# Altium schematic sheet FB_Control.SchDoc
size A4; SheetNumber: 3; SheetTotal: 3
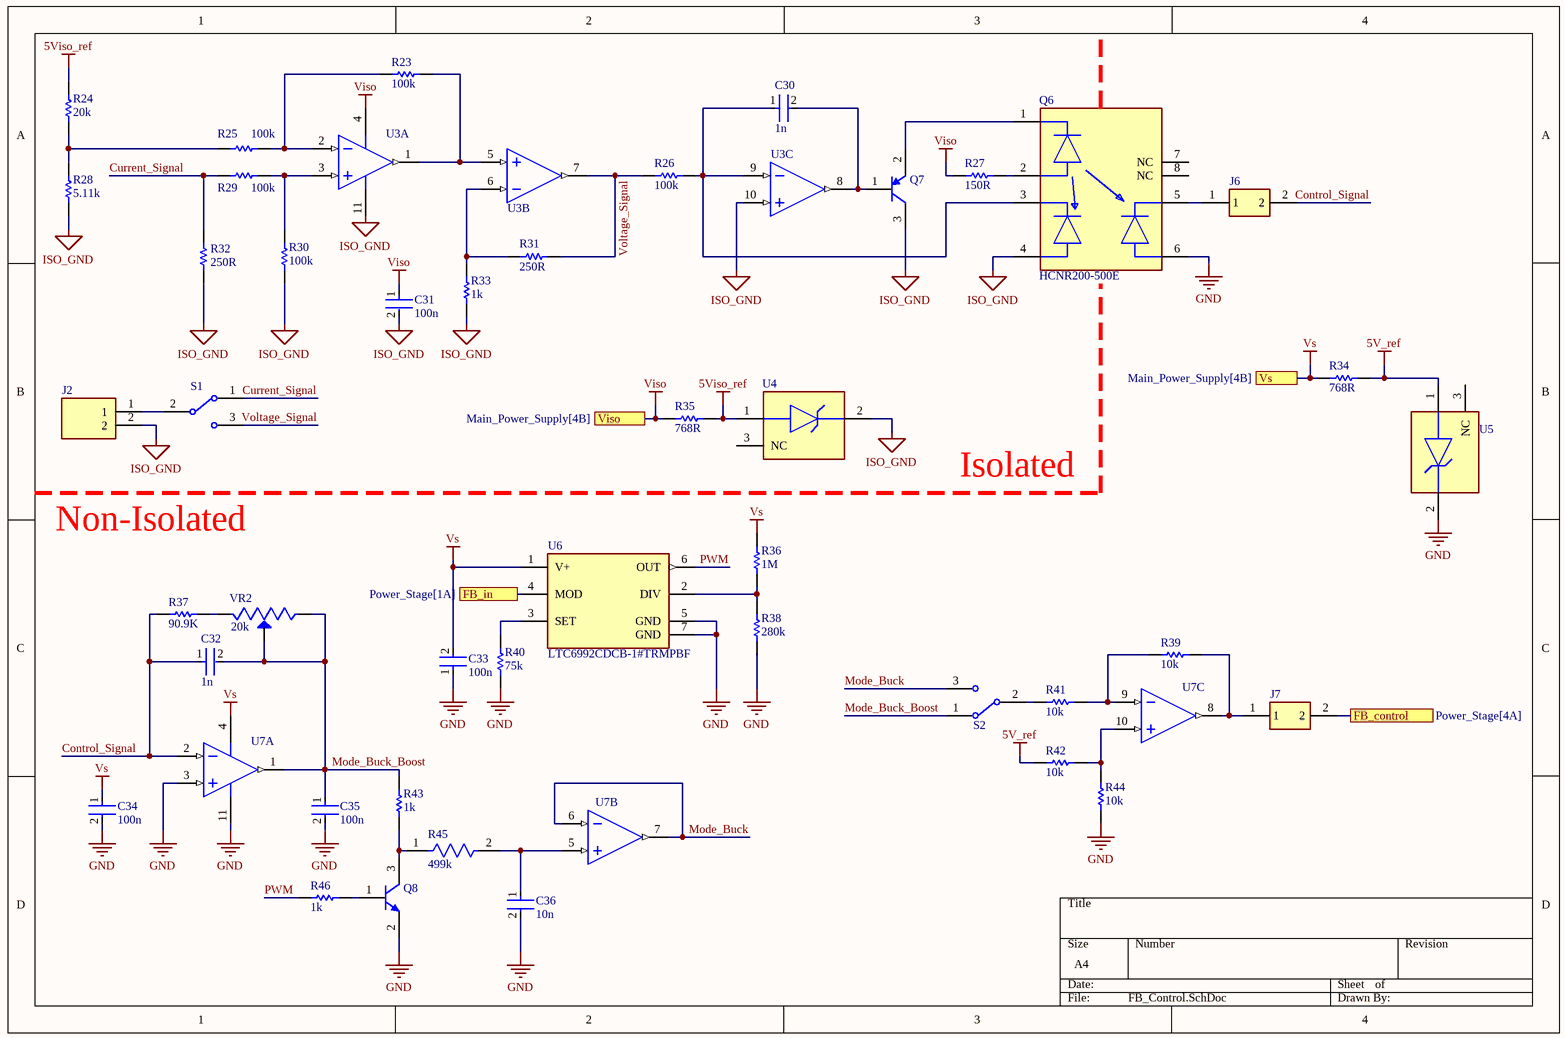
[diagram p0: FB_Control.SchDoc]

## Parts
C30  1n  [FP-1206-L_3_2_0_2-W_1_6_0-IPC_C]
C31  100n  [FP-0805-L_2_01_0_2-W_1_25-MFG]
C32  1n  [FP-1206-L_3_2_0_2-W_1_6_0-IPC_C]
C33  100n  [FP-0805-L_2_01_0_2-W_1_25-MFG]
C34  100n  [FP-0805-L_2_01_0_2-W_1_25-MFG]
C35  100n  [FP-0805-L_2_01_0_2-W_1_25-MFG]
C36  10n  [FP-0805-L_2_01_0_2-W_1_25-IPC_B]
J2  TB001-500-02BE  [TB00150002BE]  (value not drawn)
J6  22-28-4020  [MOLEX_22-28-4020]  (value not drawn)
J7  22-28-4020  [MOLEX_22-28-4020]  (value not drawn)
Q6  HCNR200-500E  [FP-HCNR200-500E-MFG]
Q7  MMBT3906TT1G  [ONSC-SC-75-3-463-01_V]  (value not drawn)
Q8  MMBT3904LT1G  [ONSC-SOT-23-3-318-08_V]  (value not drawn)
R23  100k  [RESC1608X55X30ML15T15]
R24  20k  [RESC1608X55X30ML15T15]
R25  100k  [RESC1608X55X30ML15T15]
R26  100k  [RESC1608X55X30ML15T15]
R27  150R  [RESC1608X55X30NL15T15]
R28  5.11k  [RESC1608X55X30LL15T15]
R29  100k  [RESC1608X55X30ML15T15]
R30  100k  [RESC1608X55X30ML15T15]
R31  250R  [RESC1608X55N]
R32  250R  [RESC1608X55N]
R33  1k  [RESC1608X55X30LL15T15]
R34  768R  [RESC1608X55X30LL15T15]
R35  768R  [RESC1608X55X30LL15T15]
R36  1M  [RESC1608X55X25LL10T15]
R37  90.9K  [RESC1608X55X30ML15T15]
R38  280k  [RESC1608X55X30LL15T15]
R39  10k  [RESC1609X55X30LL15T15]
R40  75k  [RESC1608X55X30NL15T15]
R41  10k  [RESC1609X55X30LL15T15]
R42  10k  [RESC1609X55X30LL15T15]
R43  1k  [RESC1608X55X30LL15T15]
R44  10k  [RESC1609X55X30LL15T15]
R45  499k  [FP-ERJ3EK-IPC_B]
R46  1k  [RESC1608X55X30LL15T15]
S1  100SP1T1B1M2QEH  [100SP1T1B4M2QE]  (value not drawn)
S2  100SP1T1B1M2QEH  [100SP1T1B4M2QE]  (value not drawn)
U3  AD8534ARUZ-REEL  [ADI-RU-14_L]  (value not drawn)  (parts A,B,C of 4)
U4  LM4040CYM3-5.0-TR  [FP-SOT23-3LD-PL-1-MFG]  (value not drawn)
U5  LM4040CYM3-5.0-TR  [FP-SOT23-3LD-PL-1-MFG]  (value not drawn)
U6  LTC6992CDCB-1#TRMPBF  [FP-DCB-6-05-08-1715-MFG]
U7  AD8534ARUZ-REEL  [ADI-RU-14_L]  (value not drawn)  (parts A,B,C of 4)
VR2  value 20k  [TRIM_3296W-1-203LF]  (hidden comment: 3296W-1-203LF)

## Ports
FB_control (see Power_Stage[4A]), FB_in (see Power_Stage[1A]), Viso (see Main_Power_Supply[4B]), Vs (see Main_Power_Supply[4B])

## Nets
5V_ref: R34.2 R42.2 U5.1(A)
5Viso_ref: R24.2 R35.2 U4.1(A)
GND: C33.1 C34.2 C35.2 C36.2 Q6.6(PD2_CATHODE) Q8.2(E) R38.1 R40.1 R44.2 U5.2(C) U6.5(GND) U6.7(GND) U7.3(+IN_A) U7.11(V-)
ISO_GND: C31.2 J2.2 Q6.4(PD1_ANODE) Q7.3(C) R28.1 R30.1 R32.1 R33.1 U3.10(+IN_C) U3.11(V-) U4.2(C)
Viso: C31.1 R27.1 R35.1 U3.4(V+) ; port Viso
Vs: C33.2 C34.1 R34.1 R36.2 U6.1(V+) U7.4(V+) ; port Vs
Control_Signal: C32.1 J6.2 R37.1 U7.2(-IN_A)
Current_Signal: R29.1 R32.2 S1.1(NC)
FB_control: J7.2 ; port FB_control
FB_in: U6.4(MOD) ; port FB_in
Mode_Buck: S2.3(NO) U7.6(-IN_B) U7.7(OUT_B)
Mode_Buck_Boost: C32.2 C35.1 R43.2 S2.1(NC) U7.1(OUT_A) VR2.1(CCW) VR2.2(WIPER)
PWM: R46.1 U6.6(OUT)
Voltage_Signal: R26.1 R31.1 S1.3(NO) U3.7(OUT_B)
NetC30_1: C30.1 Q6.3(PD1_CATHODE) R26.2 U3.9(-IN_C)
NetC30_2: C30.2 Q7.1(B) U3.8(OUT_C)
NetC36_1: C36.1 R45.2 U7.5(+IN_B)
NetJ2_1: J2.1 S1.2(COM)
NetJ6_1: J6.1 Q6.5(PD2_ANODE)
NetJ7_1: J7.1 R39.1 U7.8(OUT_C)
NetQ6_1: Q6.1(LED_CATHODE) Q7.2(E)
NetQ6_2: Q6.2(LED_ANODE) R27.2
NetQ8_1: Q8.1(B) R46.2
NetQ8_3: Q8.3(C) R43.1 R45.1
NetR23_1: R23.1 R25.2 U3.2(-IN_A)
NetR23_2: R23.2 U3.1(OUT_A) U3.5(+IN_B)
NetR24_1: R24.1 R25.1 R28.2
NetR29_2: R29.2 R30.2 U3.3(+IN_A)
NetR31_2: R31.2 R33.2 U3.6(-IN_B)
NetR36_1: R36.1 R38.2 U6.2(DIV)
NetR37_2: R37.2 VR2.3(CW)
NetR39_2: R39.2 R41.1 U7.9(-IN_C)
NetR40_2: R40.2 U6.3(SET)
NetR41_2: R41.2 S2.2(COM)
NetR42_1: R42.1 R44.1 U7.10(+IN_C)

Not connected (* = marked no-connect by the designer): Q6 7(NC) 8(NC); U4 3(NC); U5 3(NC)

## Notes on the sheet
- Isolated
- Non-Isolated

## Library data of the parts
C30 C32 = CMP-2000-05856-2: General Purpose Ceramic Capacitor, 1206, 1nF, 5%, NP0, 30ppm/°C, 100V; Dielectric: C0G; Dissipation Factor: 2.5%; Insulation Resistance: 100GR; Min Operating Temperature: -55°C; Capacitance: 1nF; Construction: Flat; Radiation Hardening: No; Voltage Rating (DC): 100V; Depth: 1.6mm; Series: -; Case Code (Metric): 3216; Temperature Coefficient: 30ppm/°C; RoHS Compliant: Yes; Max Operating Temperature: 125°C; Voltage Rating: 100V; Width: 1.6mm; Voltage: 100V; REACH SVHC: No SVHC; Packaging: Tape and Reel; Lead Free: Lead Free; Number of Pins: 2; Mount: Surface Mount; Tolerance: 5%; Height: 0.5mm; Size: 0.94mm; Package Quantity: 1; Termination: SMD/SMT; Length: 3.2mm; Contact Plating: Tin; Case Code (Imperial): 1206; Thickness: 0.037inch; Case/Package: 1206
C31 C33-C35 = CMP-2000-05808-2: General Purpose Ceramic Capacitor, 0805, 100nF, 5%, X7R, 0.15, 50V; Dissipation Factor: 2.5%; Insulation Resistance: 100GR; Length: 2.01mm; Min Operating Temperature: -55°C; Number of Pins: 2; Width: 0.049inch; Height: 0.94mm; Max Operating Temperature: 125°C; RoHS Compliant: Yes; Depth: 1.25mm; Radiation Hardening: No; Case Code (Metric): 2012; Case/Package: 0805; Contact Plating: Tin; Mount: Surface Mount; Tolerance: 5%; Dielectric Material: Ceramic; Case Code (Imperial): 0805; Capacitance: 100nF; Dielectric: X7R; Voltage Rating: 50V; REACH SVHC: No SVHC; Thickness: 0.037inch; Voltage Rating (DC): 50V; Lead Free: Lead Free; Package Quantity: 1; Packaging: Tape and Reel; Voltage: 50V; Termination: SMD/SMT
C36 = CMP-2007-04361-2: General Purpose Ceramic Capacitor, 0805, 10nF, 5%, X7R, 0.15, 50V; Insulation Resistance: 100GR; Dissipation Factor: 2.5%; Series: -; Case Code (Imperial): 0805; Voltage Rating (DC): 50V; Dielectric: X7R; Voltage Rating: 50V; Lead Free: Lead Free; Max Operating Temperature: 125°C; Depth: 1.25mm; Termination: SMD/SMT; Number of Pins: 2; Dielectric Material: Ceramic; Capacitance: 10nF; Case/Package: 0805; Contact Plating: Tin; Mount: Surface Mount; Height: 0.71mm; Package Quantity: 1; Packaging: Tape and Reel; Construction: Flat; RoHS Compliant: Yes; Voltage: 50V; Case Code (Metric): 2012; REACH SVHC: No SVHC; Tolerance: 5%; Radiation Hardening: No; Width: 0.049inch; Thickness: 0.037inch; Length: 2.01mm; Min Operating Temperature: -55°C
J2 = TB001-500-02BE: Integrated Circuit; Manufacturer_Name: CUI Devices; Datasheet Link: https://datasheet.datasheetarchive.com/originals/distributors/Datasheets_SAMA/b931254781d34eecaec474c4ccd45807.pdf; Height: 12.9mm; Manufacturer_Part_Number: TB001-500-02BE; Mouser Part Number: 490-TB001-500-02BE; Mouser Price/Stock: https://www.mouser.co.uk/ProductDetail/CUI-Devices/TB001-500-02BE?qs=vLWxofP3U2zBBnHgU5u3DA%3D%3D; Arrow Part Number: TB001-500-02BE; Arrow Price/Stock: https://www.arrow.com/en/products/tb001-500-02be/cui-devices?region=nac
J6 J7 = 22-28-4020: Connector Header Through Hole 2 position 0.100 (2.54mm); MF: Molex; MP: 22-28-4020; Purchase-URL: https://pricing.snapeda.com/search/part/22-28-4020/?ref=eda; Availability: In Stock; SnapEDA_Link: https://www.snapeda.com/parts/22-28-4020/Molex/view-part/?ref=snap; Package: None; Check_prices: https://www.snapeda.com/parts/22-28-4020/Molex/view-part/?ref=eda; Value: *; Price: None
Q6 = CMP-18400-000003-1: OPTOISO 5KV LINEAR PHVOLT 8DIPGW; Manufacturer: Broadcom; Standoff Height: 0.5mm; Min Current Transfer Ratio: 25%; Forward Current: 10mA; Forward Voltage: 1.6V; Isolation Voltage: 5000Vrms; Reverse Voltage: 2.5V; Max Current Transfer Ratio: 75%; Max Junction Temp: +125°C; Device Class L1: Optoelectronics; Device Class L3: unset; Ipc Land Pattern Name: DIP1100W48P254L1130H510Q8; Ambient Temperature Range Low: -55°C; Temperature Range High: +85°C; Device Class L2: Optocouplers; Package: 0; RoHS: TRUE; Octopart: https://octopart.com/hcnr200-500e-broadcom-71127619; Digikey Description: OPTOISO 5KV LINEAR PHVOLT 8DIPGW; ComponentLink2URL: https://docs.broadcom.com/docs/AV02-0886EN; Automotive: No; Ambient Temperature Range High: +100°C; Lead Free: Yes; Temperature Range Low: -40°C; Category: Trans; Manufacturer Part Number: HCNR200-500E; Temperature: -40°C to +85°C; ComponentLink2Description: Datasheet; Height: 5mm; Mouser Description: High Linearity Optocouplers 1 Ch 60mW 25mA
Q7 = CMP-1048-00413-1: General Purpose Transistor, PNP Silicon, 3-Pin SC-75, Pb-Free, Tape and Reel; Manufacturer: On Semiconductor; fT Min (MHz): 250; IC Continuous (A): -0.2; ComponentLink1URL: http://www.onsemi.com/; ComponentLink3Description: Package Specification; PackageDescription: 3-Pin Small Outline Transistor, Body 1.6 x 0.8 mm, Pitch 0.5 mm; ComponentLink1Description: Manufacturer URL; ComponentLink2Description: Datasheet; RoHS: TRUE; Packing: Tape and Reel; PackageVersion: Rev. F, 07/2005; PartNumber: MMBT3906TT1G; ComponentLink3URL: http://www.onsemi.com/pub_link/Collateral/463-01.PDF; PackageReference: SC-75-3-463-01; Mounting Technology: Surface Mount; Polarity: PNP; DatasheetVersion: Rev. 1; ComponentLink2URL: http://www.onsemi.cn/pub_link/Collateral/MMBT3906TT1-D.PDF
Q8 = CMP-1048-00631-1: General Purpose Transistor, NPN Silicon, 3-Pin SOT-23, Pb-Free, Tape and Reel; Manufacturer: On Semiconductor; IC Continuous (A): 0.2; fT Min (MHz): 300; ComponentLink2Description: Datasheet; Polarity: NPN; PackageDescription: 3-Pin Small Outline Transistor, Body 2.92 x 1.3 mm, Pitch 0.95 mm; ComponentLink2URL: http://www.onsemi.cn/pub_link/Collateral/MMBT3904LT1-D.PDF; DatasheetVersion: Rev. 12; Mounting Technology: Surface Mount; PartNumber: MMBT3904LT1G; ComponentLink1URL: http://www.onsemi.com/; ComponentLink3Description: Package Specification; ComponentLink1Description: Manufacturer URL; PackageVersion: Rev. AP, 11/2009; PackageReference: SOT-23-3-318-08; Packing: Tape and Reel; ComponentLink3URL: http://www.onsemi.cn/pub_link/Collateral/318-08.PDF; RoHS: TRUE
R23 R25 R26 R29 R30 = CMP-2000-00182-1: Part Number: ERJ-3EKF1003V; Manufacturer: Panasonic
R24 = CMP-2000-00318-1: Part Number: ERJ-3EKF2002V; Manufacturer: Panasonic
R27 = CMP-2000-00256-1: Part Number: ERJ-3EKF1500V; Manufacturer: Panasonic
R28 = CMP-2000-00544-1: Part Number: ERJ-3EKF5111V; Manufacturer: Panasonic
R31 R32 = RT0603BRE07250RL: Thin Film Resistors - SMD 250 ohm 0.1% 50 ppm High-Precision RT0603BRE07250RL; Manufacturer_Name: YAGEO; Datasheet Link: https://componentsearchengine.com/Datasheets/1/RT0603BRE07250RL.pdf; Height: 0.55mm; Manufacturer_Part_Number: RT0603BRE07250RL; Mouser Part Number: 603-RT0603BRE07250RL; Mouser Price/Stock: https://www.mouser.co.uk/ProductDetail/Yageo/RT0603BRE07250RL?qs=ABvmyp11Kkh0Zt9FcqbSOQ%3D%3D; Arrow Part Number: RT0603BRE07250RL; Arrow Price/Stock: https://www.arrow.com/en/products/rt0603bre07250rl/yageo; Value: 250R
R33 R43 R46 = CMP-2000-00180-1: Part Number: ERJ-3EKF1001V; Manufacturer: Panasonic
R34 R35 = CMP-2000-00640-1: Part Number: ERJ-3EKF7680V; Manufacturer: Panasonic
R36 = CMP-1659-00056-1: Chip Resistor, 1 MOhm, +/- 1%, 100 mW, -55 to 155 degC, 0603 (1608 Metric), RoHS, Tape and Reel; Voltage Rating (DC): 25 V; Tolerance: 20%; Case\Package: Radial; Capacitance: 1 mF; Min Operating Temperature: -40 degC; PackageDescription: 2-Pin Surface Mount Device, Body 1.6 x 0.8 mm; ComponentLink1Description: Manufacturer URL; Radiation Hardening: No; DatasheetVersion: Rev. 4, 02/2016; REACH SVHC: No SVHC; Length: 20 mm; Max Operating Temperature: 85 degC; Diameter: 10 mm; Packaging: Bulk; Package Quantity: 200; PackageReference: 0603; Mount: Through Hole; ComponentLink1URL: http://www.yageo.com/; ComponentLink2URL: http://www.yageo.com/documents/recent/PYu-RC_Group_51_RoHS_L_04.pdf; ComponentLink2Description: Datasheet; Width: 0 inch; Lead Pitch: 5 mm; RoHSCompliant: true; Voltage Rating: 25 V; Height: 20 mm
R37 = CMP-2000-00680-1: Manufacturer: Panasonic; Part Number: ERJ-3EKF9092V
R38 = CMP-1012-00785-2: Manufacturer: Panasonic; Part Number: ERJ-3EKF2803V
R39 R41 R42 R44 = CMP-1012-00623-3: Chip Resistor, 10 KOhm, +/- 1%, 0.1 W, -55 to 155 degC, 0603 (1608 Metric), RoHS, Tape and Reel; Manufacturer: Panasonic; Voltage Rating: 75V; Case\/Package: 0603; Power Rating: 100mW; Resistance: 10KOhm; Temperature Coefficient: 100ppm\/degreesC; Number of Pins: 2; Package Reference: 603; Depth: 0.8mm; Mount: SurfaceMount; Package Description: 2-Pin Surface Mount Device, Body 1.6 x 0.85 mm; Datasheet Version: 02/2017; Length: 1.6mm; Lead Free: LeadFree; Height: 0.45mm; Number of Terminations: 2; Max Power Dissipation: 100mW; Min Operating Temperature: -55degC; Datasheet URL: https://industrial.panasonic.com/cdbs/www-data/pdf/RDA0000/AOA0000C304.pdf; Termination: SMD/SMT; Case Code (Metric): 1608; Case Code (Imperial): 0603; Tolerance: 1%; Max Operating Temperature: 155degC; RoHSCompliant: true; Voltage Rating (DC): 75V; Radiation Hardening: No; Packaging: TapeandReel; Composition: ThickFilm; Mounting Technology: SurfaceMount; Manufacturer URL: http://www.panasonic.com/; Width: 0.031inch; REACH SVHC: NoSVHC; Contact Plating: Tin; Military Standard: Not; Package Quantity: 1
R40 = CMP-2000-00637-1: Part Number: ERJ-3EKF7502V; Manufacturer: Panasonic
R45 = CMP-2000-00537-2: RES SMD 499K OHM 1% 1/10W 0603; Voltage Rating: 75V; Max Power Dissipation: 100mW; Resistance: 499kR; Temperature Coefficient: 100ppm/°C; Voltage Rating (DC): 50V; Packaging: Tape and Reel; Termination: SMD/SMT; Tolerance: 1%; Size Code: 0603; Resistor Type: Thick Film; RoHS Compliant: Yes; Min Operating Temperature: -55°C; Power Rating: 100mW; Number of Terminations: 2; Width: 0.031inch; Package Quantity: 1; Length: 1.6mm; Contact Plating: Tin; Military Standard: Not; Case/Package: 0603; Case Code (Imperial): 0603; Construction: Rectangular; Series: ERJ; Height: 0.022inch; REACH SVHC: Yes; Depth: 0.8mm; Features: Automotive AEC-Q200; Resistance Tolerance: 1%; Max Operating Temperature: 155°C; Mount: Surface Mount; Case Code (Metric): 1608; Lead Free: Lead Free; Radiation Hardening: No
S1 S2 = 100SP1T1B1M2QEH: Switch; Manufacturer_Name: E-Switch; Datasheet Link: http://spec_sheets.e-switch.com/specs/ST110001.pdf; Height: 28mm; Manufacturer_Part_Number: 100SP1T1B1M2QEH; Mouser Part Number: 612-100-A1121; Mouser Price/Stock: https://www.mouser.co.uk/ProductDetail/E-Switch/100SP1T1B1M2QEH?qs=01kh3H%252BlXijQZiBNZaNcCA%3D%3D
U3 U7 = CMP-0384-01858-1: Quad Channel Rail-to-Rail Operational Amplifier, 3 MHz BW, 5 V/us SR, Industrial, 14-pin SOP (RU-14), Reel; Generic Part Number: AD8534; Manufacturer: Analog Devices; Input Offset Voltage: 25mV; V Span Min: 3V; Slew Rate: 5V/us; Iq/Amp: 1.25mA; Amplifiers Per Package: 4; Input Bias Current: 5pA; V Span Max: 6V; Small Signal Bandwidth: 3MHz; PartNumber: AD8534ARUZ-REEL; ComponentLink3Description: Package Specification; ComponentLink2URL: http://www.analog.com/static/imported-files/data_sheets/AD8531_8532_8534.pdf; ComponentLink2Description: Datasheet; Mounting Technology: Surface Mount; ComponentLink1Description: Manufacturer URL; DatasheetVersion: Rev. F; PackageReference: RU-14; ComponentLink3URL: http://www.analog.com/static/imported-files/packages/36057385283879153717235186773RU14.pdf; ComponentLink1URL: http://www.analog.com/en/index.html; PackageDescription: 14-Pin Thin Shrink Small Outline Package, Body 5 x 4.4 mm, Pitch 0.65 mm; Code_JEDEC: MO-153AB-1
U4 U5 = CMP-00252-66800125-1: LM4040CYM3-5.0-TR LM4040 Series 5 V ±0.5% Precision Micropower Shunt Voltage Reference-SOT-23-3; Cathode Current: 74µA; Reference Type: Fixed, Shunt; Temperature Coefficient: 100ppm/°C; Reference Voltage: 5V; Max Output Current: 15mA; Min Output Voltage: 4.75V; Number of Channels: 1; Nominal Supply Current: 500nA; Output Type: Fixed; Max Junction Temperature (Tj): 125°C; RoHS: Compliant; Length: 3.05mm; Case/Package: SOT-23; Height: 1.05mm; Output Current: 15mA; Width: 1.4mm; Current Rating: 15mA; NexarPartId: 66800125; Ambient Temperature Range High: 85°C; Tolerance: 0.5%; Min Operating Temperature: -40°C; Number of Pins: 3; Radiation Hardening: No; Lifecycle Status: Production; Number of Outputs: 1; Lead Free: Lead Free; Output Voltage: 5V; Max Operating Temperature: 85°C; Schedule B: 8542390000, 8542390000; Mount: Surface Mount; Max Output Voltage: 5V
U6 = CMP-09079-000050-1: IC OSC SILICON PROG 6-DFN; Max Supply Voltage: 5.5V; Frequency: 3.81Hz; Number of Timers/Counters: 1; Frequency Tolerance: 2.4%; Operating Supply Current: 365uA; Min Supply Voltage: 2.25V; Width: 2mm; Height: 0.75mm; Depth: 3mm; Packaging: Cut Tape; Min Operating Temperature: 0°C; Case/Package: DFN; Length: 2mm; Max Operating Temperature: 70°C; RoHS Compliant: Yes; Series: TimerBlox®; Number of Pins: 6; Package Quantity: 1; Mount: Surface Mount; Reach SVHC Compliant: Yes
VR2 = 3296W-1-203LF: Trimmer Resistors - Through Hole 3/8" 20Kohms Sealed Vertical Adjust; MF: {'manufacturer': u'Bourns'}; Package: None; Price: None; MP: 3296W-1-203LF; Availability: Unavailable